# Altium schematic sheet 舵机.SchDoc
size A4
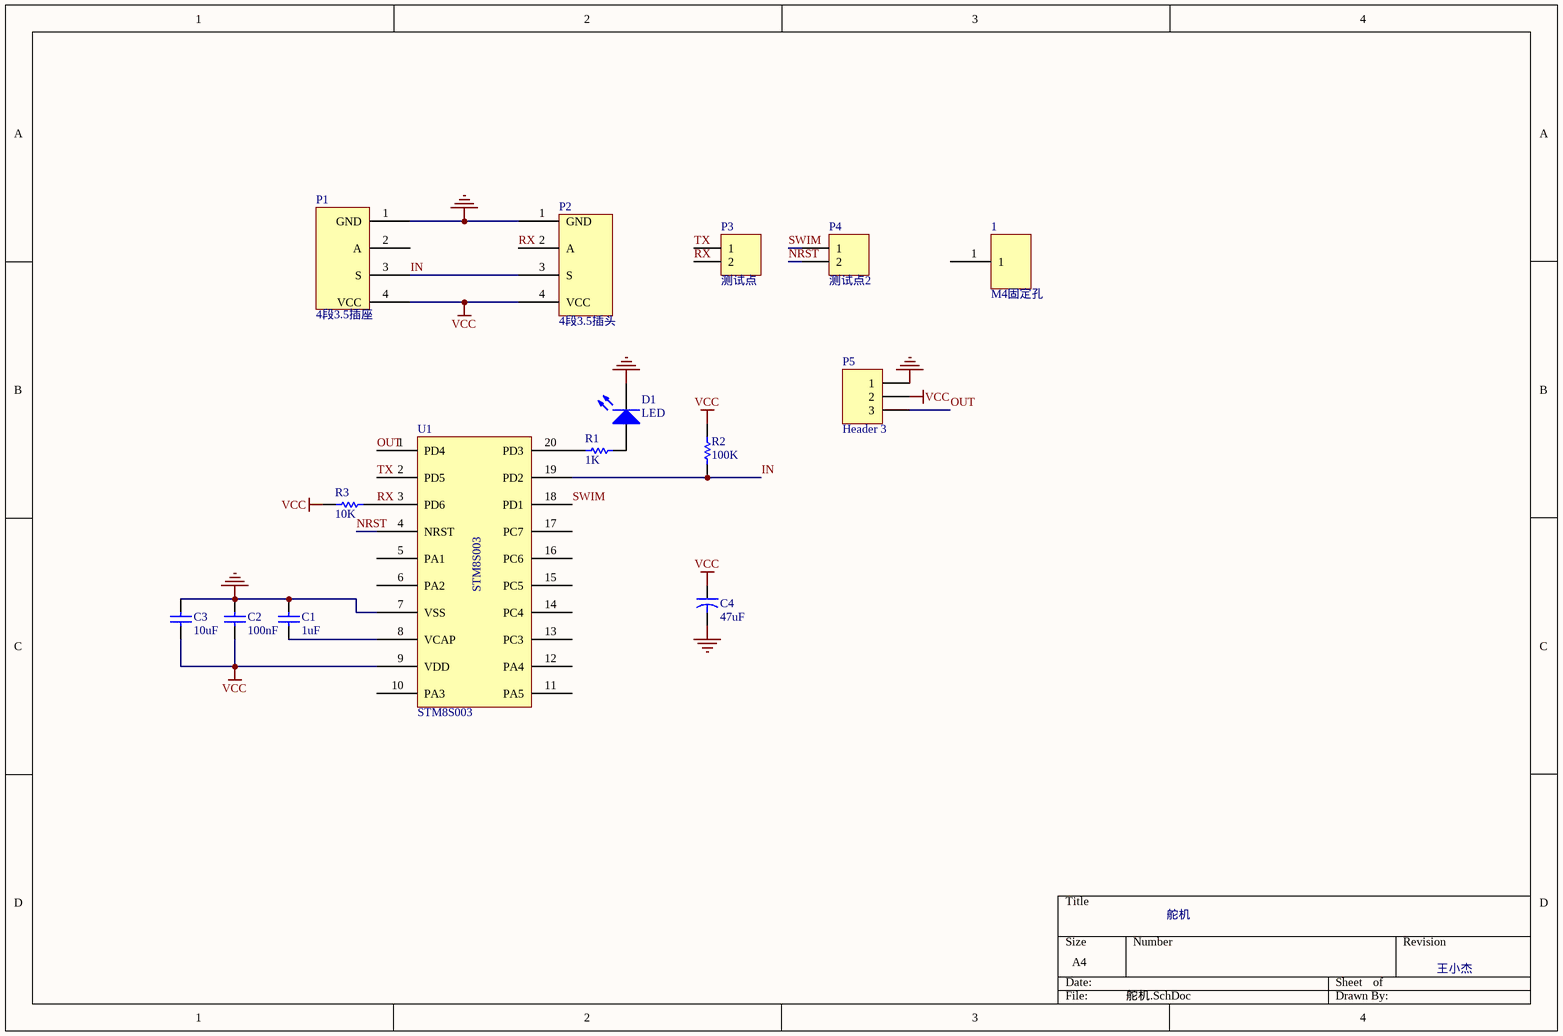
[diagram p0: 舵机.SchDoc]

## Parts
1  M4固定孔  [M4固定孔]
C1  1uF  [0603C]
C2  100nF  [0603C]
C3  10uF  [0603C]
C4  47uF  [0805C]
D1  LED  [0603D]
P1  4段3.5插座  [4段3.5耳机贴片座]
P2  4段3.5插头  [4段3.5插头]
P3  测试点  [2SMT-2.54]
P4  测试点2  [2SMT-2.54]
P5  Header 3  [3pin弯脚]
R1  1K  [0603R]
R2  100K  [0603R]
R3  10K  [0603R]
U1  STM8S003  [TSSOP20]

## Nets
GND: C1.2 C2.2 C3.2 C4.2 D1.2(K) P1.1(GND) P2.1(GND) P5.1 U1.7(VSS)
VCC: C2.1 C3.1 C4.1 P1.4(VCC) P2.4(VCC) P5.2 R2.2 R3.2 U1.9(VDD)
IN: P1.3(S) P2.3(S) R2.1 U1.19(PD2)
NRST: P4.2 U1.4(NRST)
OUT: P5.3 U1.1(PD4)
RX: P2.2(A) P3.2 R3.1 U1.3(PD6)
SWIM: P4.1 U1.18(PD1)
TX: P3.1 U1.2(PD5)
NetC1_1: C1.1 U1.8(VCAP)
NetD1_1: D1.1(A) R1.2
NetR1_1: R1.1 U1.20(PD3)

Not connected (* = marked no-connect by the designer): 1 1; P1 2(A); U1 5(PA1) 6(PA2) 10(PA3) 11(PA5) 12(PA4) 13(PC3) 14(PC4) 15(PC5) 16(PC6) 17(PC7)

## Notes on the sheet
- 舵机
- 王小杰

## Library data of the parts
C1-C3 = Cap: Capacitor; Value: 100pF; Published: 8-Jun-2000; LatestRevisionDate: 17-Jul-2002; LatestRevisionNote: Re-released for DXP Platform.; PackageReference: RAD-0.3; Publisher: Altium Limited; PackageDescription: Radial Cap, Thru-Hole; 2 Leads; 0.3 in Pin Spacing
C4 = Cap2: Capacitor; Value: 100pF; Published: 23-Sep-2002; PackageReference: CAPR5-4X5; Publisher: Altium Limited; PackageDescription: Capacitor; 2 Leads
D1 = LED0: Typical INFRARED GaAs LED; Published: 8-Jun-2000; LatestRevisionDate: 08-Jul-2005; LatestRevisionNote: Mech Layer 1 removed.; PackageReference: LED-0; Publisher: Altium Limited; PackageDescription: LED; 2 Leads
P3 P4 = Header 2: Header, 2-Pin; LatestRevisionDate: 17-Jul-2002; LatestRevisionNote: Re-released for DXP Platform.; Publisher: Altium Limited
P5 = Header 3: Header, 3-Pin; LatestRevisionDate: 17-Jul-2002; LatestRevisionNote: Re-released for DXP Platform.; Publisher: Altium Limited
R1 = Res1: Resistor; Published: 8-Jun-2000; LatestRevisionDate: 17-Jul-2002; LatestRevisionNote: Re-released for DXP Platform.; PackageReference: AXIAL-0.3; Publisher: Altium Limited; PackageDescription: Axial Device, Thru-Hole; 2 Leads; 0.3 in Pin Spacing; Value: 1K
R2 R3 = Res1: Resistor; Value: 1K; Published: 8-Jun-2000; LatestRevisionDate: 17-Jul-2002; LatestRevisionNote: Re-released for DXP Platform.; PackageReference: AXIAL-0.3; Publisher: Altium Limited; PackageDescription: Axial Device, Thru-Hole; 2 Leads; 0.3 in Pin Spacing